# Altium schematic sheet sch_2023-05-29.schdoc
size 106 x 87 mm
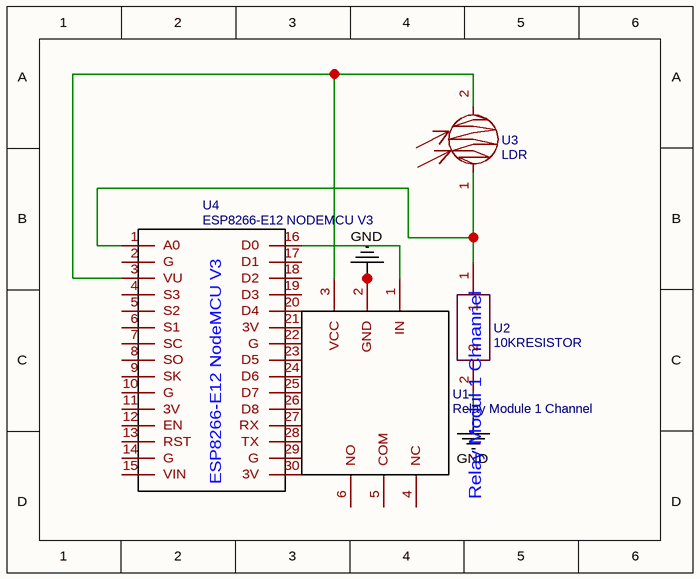
[diagram p0: sch_2023-05-29.schdoc]

## Parts
U1  Relay Module 1 Channel  [RELAY MODULE HW-279 2 RELAYS]
U2  10KRESISTOR  [10KRESISTOR]
U3  LDR  [LDR]
U4  ESP8266-E12 NODEMCU V3  [ESP8266-E12-NODEMCU-V3]

## Nets
GND: U1.2(GND) U2.2
NetU1_1: U1.1(IN) U4.16(D0)
NetU1_3: U1.3(VCC) U3.2 U4.3(VU)
NetU2_1: U2.1 U3.1 U4.1(A0)

Not connected (* = marked no-connect by the designer): U1 4(NC) 5(COM) 6(NO); U4 2(G) 4(S3) 5(S2) 6(S1) 7(SC) 8(SO) 9(SK) 10(G) 11(3V) 12(EN) 13(RST) 14(G) 15(VIN) 17(D1) 18(D2) 19(D3) 20(D4) 21(3V) 22(G) 23(D5) 24(D6) 25(D7) 26(D8) 27(RX) 28(TX) 29(G) 30(3V)

## Notes on the sheet
- (in symbol ESP8266-E12 NODEMCU V3) ESP8266-E12 NodeMCU V3
- (in symbol Relay Module 1 Channel) Relay Modul 1 Chnannel

## Library data of the parts
U1 = Relay Module 1 Channel: Contributor: Haramu4a; BOM_Manufacturer Part: Relay Module hw-279 2 relays; spicePre: U; spiceSymbolName: Relay Module 1 Channel
U2 = 10KRESISTOR: BOM_Manufacturer: MULTICOMP PRO; BOM_Manufacturer Part: MCMF0W4DF1002A50; Contributor: alexandriamckie; BOM_Supplier Part: 1563077; BOM_Supplier: Element14; link: https://au.element14.com/multicomp/mcmf0w4df1002a50/res-10k-0-50-250mw-axial/dp/1563077; spicePre: U; spiceSymbolName: 10KRESISTOR
U3 = LDR: Contributor: PatoViejo; spicePre: U; spiceSymbolName: LDR
U4 = ESP8266-E12 NODEMCU V3: Contributor: sigmur; spicePre: U; spiceSymbolName: ESP8266-E12 NODEMCU V3